# EAGLE design master (EAGLE 9.2.2)
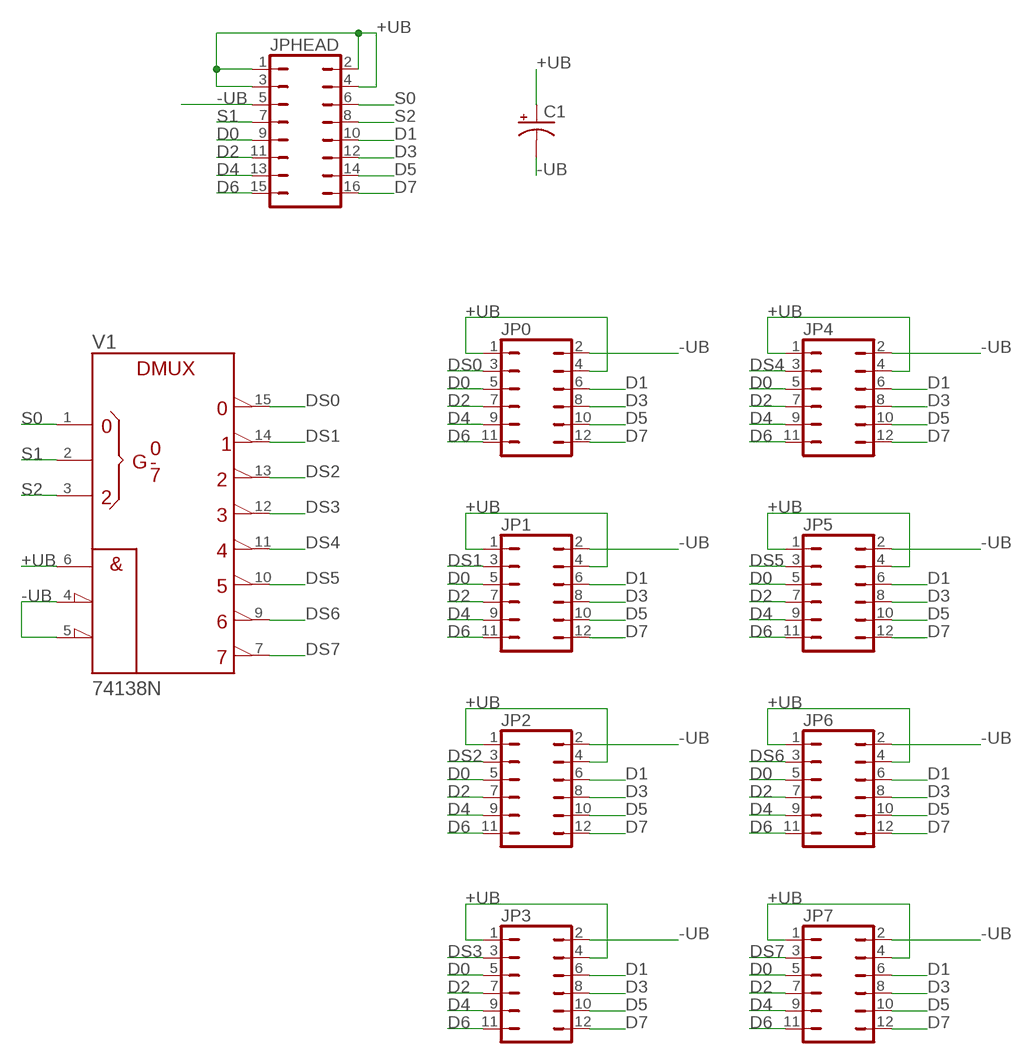
[diagram p0: schematic, sheet 1]

## Parts
C1  CPOL-USTT2D4  [TT2D4]
JP0  JP6Q  [JP6Q]
JP1  JP6Q  [JP6Q]
JP2  JP6Q  [JP6Q]
JP3  JP6Q  [JP6Q]
JP4  JP6Q  [JP6Q]
JP5  JP6Q  [JP6Q]
JP6  JP6Q  [JP6Q]
JP7  JP6Q  [JP6Q]
JPHEAD  JP8Q  [JP8Q]
V1  74138N  [DIL16]

## Nets
+UB: C1.+ JP0.1 JP0.4 JP1.1 JP1.4 JP2.1 JP2.4 JP3.1 JP3.4 JP4.1 JP4.4 JP5.1 JP5.4 JP6.1 JP6.4 JP7.1 JP7.4 JPHEAD.1 JPHEAD.2 JPHEAD.3 JPHEAD.4 V1.6(G1)
-UB: C1.- JP0.2 JP1.2 JP2.2 JP3.2 JP4.2 JP5.2 JP6.2 JP7.2 JPHEAD.5 V1.4(!G2A) V1.5(!G2B)
D0: JP0.5 JP1.5 JP2.5 JP3.5 JP4.5 JP5.5 JP6.5 JP7.5 JPHEAD.9
D1: JP0.6 JP1.6 JP2.6 JP3.6 JP4.6 JP5.6 JP6.6 JP7.6 JPHEAD.10
D2: JP0.7 JP1.7 JP2.7 JP3.7 JP4.7 JP5.7 JP6.7 JP7.7 JPHEAD.11
D3: JP0.8 JP1.8 JP2.8 JP3.8 JP4.8 JP5.8 JP6.8 JP7.8 JPHEAD.12
D4: JP0.9 JP1.9 JP2.9 JP3.9 JP4.9 JP5.9 JP6.9 JP7.9 JPHEAD.13
D5: JP0.10 JP1.10 JP2.10 JP3.10 JP4.10 JP5.10 JP6.10 JP7.10 JPHEAD.14
D6: JP0.11 JP1.11 JP2.11 JP3.11 JP4.11 JP5.11 JP6.11 JP7.11 JPHEAD.15
D7: JP0.12 JP1.12 JP2.12 JP3.12 JP4.12 JP5.12 JP6.12 JP7.12 JPHEAD.16
DS0: JP0.3 V1.15(Y0)
DS1: JP1.3 V1.14(Y1)
DS2: JP2.3 V1.13(Y2)
DS3: JP3.3 V1.12(Y3)
DS4: JP4.3 V1.11(Y4)
DS5: JP5.3 V1.10(Y5)
DS6: JP6.3 V1.9(Y6)
DS7: JP7.3 V1.7(Y7)
S0: JPHEAD.6 V1.1(A)
S1: JPHEAD.7 V1.2(B)
S2: JPHEAD.8 V1.3(C)

## Power pins joined to a net without a drawn wire
+UB: V1.16(+UB)
-UB: V1.8(-UB)

## Library data of the parts
C1 = rcl:CPOL-US: POLARIZED CAPACITOR, American symbol; SPICEPREFIX: C
JP0 JP1-JP7 = jumper:JP6Q: JUMPER
JPHEAD = jumper:JP8Q: JUMPER
V1 = 74ttl-din:74*138: 3-line to 8-line DECODER/DEMULTIPLEXER

## Board
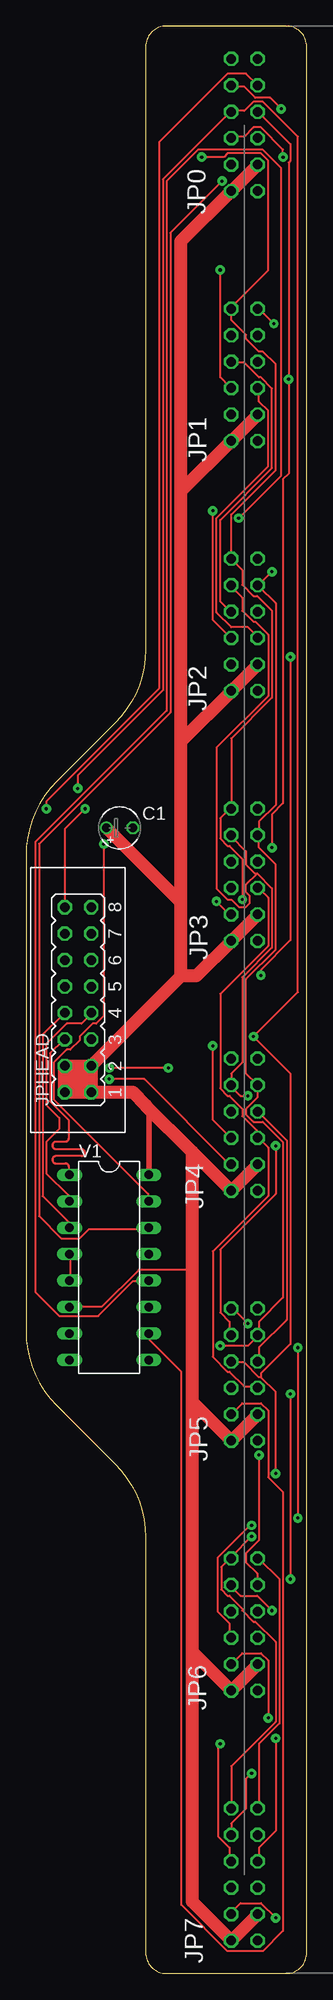
[diagram p1: board, top side]
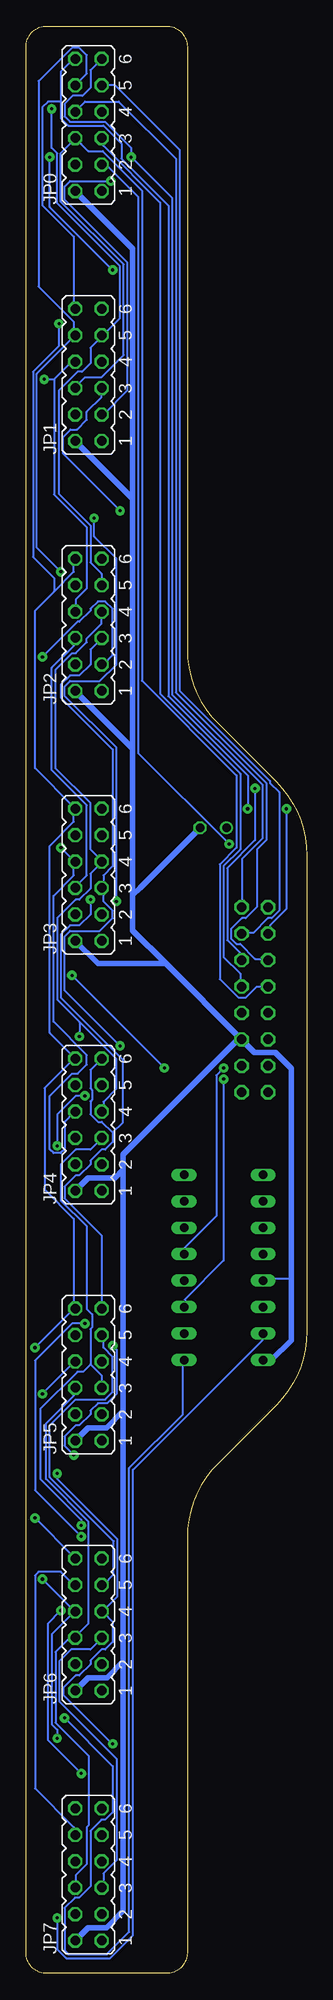
[diagram p2: board, bottom side, seen from below]

Size 27 x 187 mm. Coordinates in mm from the lower left corner, seen from the top.
Outline: 11.5,41.86 11.5,2 arc90 13.5,0 25,0 arc90 27,2 27,185 arc90 25,187 13.5,187 arc90 11.5,185 11.5,127.14 arc-45 8.57,120.07 2.93,114.43 arc45 0,107.36 0,61.64 arc45 2.93,54.57 8.57,48.93 arc-45 11.5,41.86
Copper layers (1*16): Top 0.035mm / dielectric 1.6mm / Bottom 0.035mm
Design rules "default *": minimum track width 8mil, minimum drill 0.3mm, track to track 6mil, track to pad 6mil, pad to pad 6mil, via to via 6mil, smd to smd 6mil, copper to edge 10mil, drill to drill 6mil, minimum pad ring 5mil, minimum via ring 0.3mm, stop-mask expansion 4mil, vias tented up to drill 0mil, thermal gap 10mil

### Footprints (pad centres in the part's own frame; a part is rotated, then mirrored left to right if it is on the bottom)
TT2D4 = drill 0.813: + -1.27,0 | drill 0.813 octagon: - 1.27,0
JP6Q = drill 0.914 octagon: 1 -6.35,-1.27; 2 -6.35,1.27; 3 -3.81,-1.27; 4 -3.81,1.27; 5 -1.27,-1.27; 6 -1.27,1.27; 7 1.27,-1.27; 8 1.27,1.27; 9 3.81,-1.27; 10 3.81,1.27; 11 6.35,-1.27; 12 6.35,1.27
JP8Q = drill 0.914 octagon: 1 -8.89,-1.27; 2 -8.89,1.27; 3 -6.35,-1.27; 4 -6.35,1.27; 5 -3.81,-1.27; 6 -3.81,1.27; 7 -1.27,-1.27; 8 -1.27,1.27; 9 1.27,-1.27; 10 1.27,1.27; 11 3.81,-1.27; 12 3.81,1.27; 13 6.35,-1.27; 14 6.35,1.27; 15 8.89,-1.27; 16 8.89,1.27
DIL16 = drill 0.813 long: 1 -8.89,-3.81; 2 -6.35,-3.81; 3 -3.81,-3.81; 4 -1.27,-3.81; 5 1.27,-3.81; 6 3.81,-3.81; 7 6.35,-3.81; 8 8.89,-3.81; 9 8.89,3.81; 10 6.35,3.81; 11 3.81,3.81; 12 1.27,3.81; 13 -1.27,3.81; 14 -3.81,3.81; 15 -6.35,3.81; 16 -8.89,3.81

### Placement (x,y rotation side)
C1  9,110 0 top
JP0  21,177.5 90 bottom
JP1  21,153.5 90 bottom
JP2  21,129.5 90 bottom
JP3  21,105.5 90 bottom
JP4  21,81.5 90 bottom
JP5  21,57.5 90 bottom
JP6  21,33.5 90 bottom
JP7  21,9.5 90 bottom
JPHEAD  5,93.5 90 top
V1  8,67.8 270 top

### Tracks (layer width: path | path; a pad name or v marks a point on that pad's centre or on a via)
+UB
  Top 0.203: 15.99,67.56 10.85,67.56 7.29,64.01 4.27,64.01 V1.6
  Top 0.508: V1.16 11.81,83.07 11.52,83.36
  Top 1.27: JPHEAD.4 JPHEAD.1 | JPHEAD.3 JPHEAD.2 | JPHEAD.2 JPHEAD.4 | JPHEAD.4 JPHEAD.3 | JPHEAD.3 JPHEAD.1 | JPHEAD.1 JPHEAD.2 | JPHEAD.3 14.9,95.78 | 14.9,142.32 JP1.1 JP1.4 | 14.9,95.78 14.9,102.83 | 14.9,102.83 14.9,118.32 | 14.9,118.32 14.9,142.32 | JP2.4 JP2.1 14.9,118.32 | JP3.4 JP3.1 16.36,95.78 14.9,95.78 | C1.+ 14.9,102.83 | 15.99,78.89 JP4.1 JP4.4 | 15.99,78.89 11.52,83.36 10.27,84.61 JPHEAD.1 | 15.99,54.89 JP5.1 JP5.4 | 15.99,54.89 15.99,67.56 15.99,78.89 | 15.99,30.89 JP6.1 JP6.4 | 15.99,30.89 15.99,54.89 | JP7.4 JP7.1 15.99,6.89 15.99,30.89 | 14.9,142.32 14.9,166.32 JP0.1 JP0.4
-UB
  Top 0.203: V1.5 4.27,66.67 4.27,68.99 V1.4
  Bottom 0.203: 1.5,66.67 4.09,66.67 V1.5
  Bottom 0.508: 13.54,96.96 16.75,100.17 16.75,103.52 16.73,103.53 | 13.54,96.96 JPHEAD.5 | 16.73,141.62 16.73,117.61 | 16.73,117.61 16.73,103.53 | JP3.2 20.08,96.96 13.54,96.96 | C1.- 16.05,104.22 16.73,103.53 | JP2.2 16.73,117.61 | JP1.2 16.73,141.62 | V1.8 3.39,58.91 1.5,60.8 1.5,66.67 1.5,86.9 3.05,88.45 5.03,88.45 JPHEAD.5 | JP4.2 21.02,76.4 18.45,76.4 17.65,77.2 | 17.65,77.2 17.65,78.65 6.61,89.69 JPHEAD.5 | JP5.2 21.02,52.4 19.25,52.4 17.65,54 | 17.65,54 17.65,77.2 | JP6.2 21.02,28.4 19.2,28.4 17.65,29.95 | 17.65,29.95 17.65,54 | JP7.2 21.02,4.4 19.25,4.4 17.65,6 17.65,29.95 | JP0.2 16.73,165.62 16.73,141.62
D0  (via drill 0.3)
  Top 0.203: v17.96,140.46 17.96,129.97 19.56,128.37 JP2.5 | v21.69,43.03 21.51,43.03 18.41,39.93 18.41,34.75 19.56,33.6 19.56,32.36 JP6.5 | v17.96,89.08 17.96,81.97 19.56,80.37 JP4.5 | v24.71,174.42 24.71,175.13 22.58,177.27 21.87,177.27 20.98,176.38 19.74,176.38 JP0.5 | v18.67,163.58 18.67,153.26 19.56,152.38 JP1.5
  Bottom 0.203: JPHEAD.9 6.4,94.94 6.4,96.01 8,97.61 8,106.32 6.4,107.92 6.4,115.21 14.11,122.92 14.11,170.04 19.56,175.49 19.56,176.2 JP0.5 | JP2.5 19.74,128.19 20.8,127.13 20.8,125.7 21.87,124.64 22.76,124.64 23.65,123.75 23.65,122.5 18.67,117.53 18.67,106.32 19.56,105.44 19.56,104.37 JP3.5 19.56,104.19 19.56,102.95 18.67,102.06 18.67,101.35 19.91,100.1 22.76,100.1 23.29,99.57 23.29,94.41 v17.96,89.08 | v17.96,140.46 23.44,145.95 23.44,147.52 22.71,148.26 22.1,148.26 21.16,149.2 21.16,149.96 19.74,151.38 19.74,152.2 JP1.5 | JP7.5 19.56,8.36 19.56,9.6 18.31,10.85 18.31,20.62 23.8,26.11 23.8,29.99 22.68,31.11 20.8,31.11 19.74,32.18 JP6.5 | 20.8,58.5 19.74,57.43 19.74,56.36 JP5.5 | 20.8,58.5 20.8,61.87 20.62,62.05 20.62,63.3 21.16,63.83 21.16,71.76 23.65,74.25 23.65,77.7 22.23,79.12 20.8,79.12 19.74,80.19 JP4.5 | v21.69,43.03 21.69,43.56 25.62,47.49 25.62,54.21 22.05,57.78 21.51,57.78 20.8,58.5 | v24.71,174.42 24.71,169.62 v18.67,163.58
D1
  Top 0.203: JP3.6 22.4,104.19 23.29,103.3 23.29,98.68 18.67,94.06 18.67,84.99 19.38,84.28 19.56,84.28 20.8,83.03 20.8,82.32 22.23,80.9 22.23,80.37 JP4.6 22.4,80.19 23.29,79.3 23.29,74.68 17.96,69.34 17.96,59.21 19.38,57.78 19.56,57.78 20.98,56.36 22.23,56.36 JP5.6 | JP1.6 22.4,152.2 22.4,150.95 23.29,150.06 23.29,144.73 18.31,139.75 18.31,130.68 19.74,129.26 21.34,129.26 22.23,128.37 JP2.6
  Bottom 0.203: 22.23,176.2 21.69,175.67 21.01,174.98 19.64,174.98 15.86,171.21 15.86,124.14 6.76,115.04 6.76,108.1 8.36,106.5 8.36,95.48 6.58,93.7 5.87,93.7 4.8,94.77 JPHEAD.10 | 22.23,176.2 22.24,176.22 23.65,174.81 23.65,170.16 17.6,164.11 17.6,155.4 19.74,153.26 21.34,153.26 22.23,152.38 JP1.6 | 22.23,176.2 JP0.6 | JP7.6 22.23,8.36 22.23,9.42 21.16,10.49 21.16,14.05 20.98,14.22 20.98,20.91 24.15,24.08 24.15,30.88 22.8,32.23 JP6.6 22.23,32.36 20.98,33.6 20.98,43.38 25.07,47.47 25.07,52.81 22.4,55.47 22.4,56.19 JP5.6 | JP2.6 22.4,128.19 22.4,127.48 24.51,125.38 24.51,115.54 21.16,112.19 21.16,105.44 22.23,104.37 JP3.6
D2  (via drill 0.3)
  Top 0.203: v4.98,113.79 4.98,115.04 13.16,123.22 13.16,172.29 19.56,178.69 JP0.7 19.74,178.87 20.98,178.87 21.87,179.76 22.76,179.76 26.14,176.38 26.14,94.23 v21.87,89.97 25.43,86.41 25.43,60.45 22.58,57.61 22.58,57.25 | v18.67,22.05 18.47,21.85 18.47,13.18 19.56,12.09 19.56,10.85 JP7.7 | 22.58,57.25 22.4,57.25 20.98,58.67 19.74,58.67 JP5.7 | 22.58,57.25 24,55.83 v24,48.01 | JP1.7 19.74,154.69 20.98,154.69 22.4,153.26 22.58,153.26 23.65,152.2 23.65,144.55 18.67,139.57 18.67,131.75 19.56,130.86 JP2.7
  Bottom 0.203: v4.98,113.79 4.98,108.81 7.64,106.15 7.64,99.21 6.4,97.97 6.4,97.43 JPHEAD.11 | v18.67,22.05 18.72,22.05 23.44,26.77 23.44,27.41 22.23,28.63 21.87,28.63 20.8,29.69 20.8,30.05 19.74,31.11 19.38,31.11 18.67,31.83 18.67,33.78 19.56,34.67 JP6.7 19.56,34.85 18.21,36.19 18.21,41.68 24,47.47 v24,48.01 | 21.83,91.35 24,93.52 24,101.35 22.23,103.12 21.87,103.12 20.8,104.19 20.8,105.61 19.74,106.68 JP3.7 19.74,106.86 20.8,107.92 20.8,112.37 24.15,115.72 24.15,125.2 22.58,126.77 22.23,126.77 21.16,127.84 21.16,128.19 19.74,129.62 19.74,130.68 JP2.7 | 21.83,91.35 18.32,87.84 18.32,84.94 19.56,83.7 19.56,82.86 JP4.7 | 21.83,91.35 21.85,91.35 21.85,90 v21.87,89.97
D3  (via drill 0.3)
  Top 0.203: v24,22.58 24,13.69 22.4,12.09 22.4,10.85 JP7.8 | JP5.8 22.4,58.85 22.4,60.1 25.07,62.76 25.07,80.01 22.4,82.68 JP4.8 | v25.43,55.65 v25.43,37.87 | JP0.8 22.4,178.69 25.43,175.67 25.43,174.07 25.25,173.89 v25.25,153.09 25.25,144.02 24.71,143.49 24.71,112.37 23.65,111.3 v23.65,108.1
  Bottom 0.203: v24,22.58 24,23.4 24.51,23.9 24.51,32.56 22.4,34.67 JP6.8 22.4,34.85 v25.43,37.87 | JP4.8 22.4,82.68 23.29,81.79 23.29,79.12 23.65,78.77 24.36,78.77 24.71,79.12 24.71,84.28 22.58,86.41 22.02,86.41 21.16,87.28 21.16,88.19 24.36,91.39 24.36,103.48 22.4,105.44 22.4,106.68 JP3.8 22.4,106.86 v23.65,108.1 | v25.43,55.65 22.4,58.67 JP5.8 | 24.3,153.09 24.3,142.01 21.16,138.86 21.16,132.99 22.23,131.93 22.23,130.86 JP2.8 | 24.3,153.09 22.8,154.59 22.52,154.77 JP1.8 | JPHEAD.12 3.73,97.43 4.98,97.43 6.4,98.86 6.76,98.86 7.29,99.39 7.29,100.28 6.22,101.35 5.87,101.35 4.8,102.41 4.8,107.92 3.91,108.81 3.91,114.33 12.59,123 12.59,174.27 18.08,179.76 21.34,179.76 22.23,178.87 JP0.8 | v25.25,153.09 24.3,153.09
D4  (via drill 0.3)
  Top 0.203: v21.69,19.2 21.16,18.67 21.16,15.82 19.74,14.4 19.74,13.34 JP7.9 | v23.65,34.85 22.23,36.27 20.62,36.27 19.74,37.16 JP6.9 | 22.23,105.61 22.2,105.64 22.02,105.64 21.16,106.5 21.16,107.75 19.74,109.17 JP3.9 | 22.23,105.61 23.65,104.19 23.65,98.5 20.8,95.66 20.8,87.48 19.74,86.41 19.74,85.34 JP4.9 19.74,85.17 20.62,84.28 v21.34,84.28 | 22.23,105.61 21.16,104.55 21.16,103.83 21.51,103.48 21.51,102.77 21.16,102.41 20.45,102.41 19.74,103.12 19.38,103.12 18.31,104.19 18.31,117.7 23.29,122.68 23.29,128.55 22.05,129.79 21.87,129.79 20.8,130.86 20.8,132.1 19.74,133.17 JP2.9 | v24,79.48 24,74.85 18.67,69.52 18.67,63.48 19.56,62.59 19.56,61.34 JP5.9 | v24.54,179.04 23.47,180.11 22.05,180.11 20.98,181.18 19.74,181.18 JP0.9
  Bottom 0.203: JPHEAD.13 6.22,99.92 5.16,99.92 3.73,101.35 3.38,101.35 2.67,102.06 2.67,113.44 3.56,114.33 3.56,114.5 12.23,123.18 12.23,175.1 18.44,181.31 JP0.9 | v21.69,19.2 24.91,22.43 24.91,33.58 v23.65,34.85 | JP5.9 19.56,61.16 19.56,60.1 18.67,59.21 18.67,55.83 19.38,55.12 22.23,55.12 24.71,52.63 24.71,47.65 18.57,41.51 18.57,38.33 19.56,37.34 JP6.9 | JP2.9 19.74,133.35 19.74,134.42 20.8,135.48 20.8,139.04 23.85,142.08 23.85,152 22.05,153.8 21.62,153.8 20.8,154.61 20.8,156.11 19.74,157.18 JP1.9 19.56,157.35 17.96,158.95 17.96,163.93 24,169.98 24,174.78 24.54,175.31 v24.54,179.04 | v24,79.48 24,82.5 22.23,84.28 v21.34,84.28
D5  (via drill 0.3)
  Top 0.203: v1.96,111.84 1.96,112.55 12.8,123.39 12.8,175.84 19.38,182.42 21.16,182.42 22.23,181.36 JP0.10 | v22.4,49.78 22.4,41.6 21.16,40.36 21.16,39.47 22.23,38.41 22.23,37.34 JP6.10 | v18.67,60.27 21.34,60.27 22.23,61.16 JP5.10 22.4,61.34 22.4,62.59 24.71,64.9 24.71,79.83 22.76,81.79 21.87,81.79 21.16,82.5 21.16,83.03 22.23,84.1 22.23,85.17 JP4.10 22.23,85.34 21.16,86.41 21.16,95.48 24,98.32 24,106.5 22.4,108.1 22.4,109.17 JP3.10 22.4,109.35 22.4,110.59 24,112.19 24,131.57 22.4,133.17 JP2.10 22.4,133.35 v23.65,134.59
  Bottom 0.203: v1.96,111.84 1.96,102.23 3.56,100.64 3.56,99.92 JPHEAD.14 | JP0.10 22.23,181.36 21.16,182.42 21.16,184.2 21.87,184.91 22.58,184.91 25.78,181.71 25.78,161.98 22.4,158.6 22.4,157.35 JP1.10 22.4,157.18 25.96,153.62 25.96,136.91 v23.65,134.59 | JP7.10 22.4,13.34 22.4,14.05 26.14,17.78 26.14,38.23 25.78,38.58 23.65,38.58 22.4,37.34 JP6.10 | v22.4,49.78 23.29,50.67 23.29,51.56 22.23,52.63 21.87,52.63 20.8,53.7 20.8,54.05 20.09,54.76 19.2,54.76 18.31,55.65 18.31,59.92 v18.67,60.27
D6  (via drill 0.3)
  Top 0.203: JP7.11 19.74,16 19.74,19.91 24,24.18 24,31.83 22.05,33.78 21.87,33.78 20.8,34.85 20.8,35.03 19.56,36.27 19.38,36.27 18.77,36.88 18.77,39.04 19.56,39.83 JP6.11 19.74,40.01 v21.69,41.96 | v20.8,103.12 20.8,107.04 19.56,108.28 19.38,108.28 18.67,108.99 18.67,110.95 19.56,111.84 JP3.11 19.74,112.01 19.74,118.59 23.65,122.5 23.65,130.86 22.23,132.28 21.87,132.28 20.8,133.35 20.8,134.77 19.74,135.84 JP2.11 19.74,136.02 19.74,140.11 24,144.37 24,154.51 22.76,155.75 22.4,155.75 21.16,157 21.16,157.35 19.74,158.78 JP1.11 19.74,160.02 23.29,163.58 23.29,174.07 22.58,174.78 19.38,174.78 19.02,174.42 v16.89,174.42 | v21.34,62.41 19.74,64.01 JP5.11
  Bottom 0.203: JPHEAD.15 6.22,102.41 6.22,107.04 4.27,108.99 4.27,114.15 12.95,122.83 12.95,170.52 16.89,174.46 v16.89,174.42 16.89,175.31 19.38,177.8 22.76,177.8 23.29,178.33 23.29,179.52 22.52,180.29 21.57,180.29 20.8,181.06 20.8,182.78 JP0.11 | 18.66,80.73 19.71,81.79 20.09,81.79 20.8,82.5 20.8,83.74 20.62,83.92 20.62,84.81 20.8,84.99 20.8,86.77 19.74,87.83 JP4.11 | 18.66,80.73 18.67,80.72 18.67,79.83 19.38,79.12 19.74,79.12 20.8,78.05 20.8,77.7 21.87,76.63 22.23,76.63 23.29,75.56 23.29,74.43 19.74,70.87 19.74,64.01 JP5.11 | 18.66,80.73 17.71,81.68 17.71,87.77 23.65,93.7 23.65,99.75 22.76,100.64 21.87,100.64 20.8,101.7 v20.8,103.12 | v21.69,41.96 26.14,46.41 26.14,58.85 22.58,62.41 v21.34,62.41
D7  (via drill 0.3)
  Top 0.203: v5.69,111.84 3.73,109.88 3.73,102.41 JPHEAD.16 | JP7.12 22.4,16 22.4,22.05 24.36,24 24.36,37.87 22.4,39.83 JP6.12 | v26.14,60.1 v26.14,43.74 | v23.82,158.42 22.4,159.84 JP1.12
  Bottom 0.203: v5.69,111.84 5.69,115.04 13.3,122.65 13.3,169.77 17.82,174.28 17.82,175.71 19.56,177.44 22.94,177.44 23.65,178.16 23.65,179.76 | 23.65,179.76 23.65,182.6 22.4,183.84 JP0.12 | 23.65,179.76 24.89,179.76 25.43,179.22 25.43,169.8 22.4,166.78 22.4,160.02 JP1.12 | 24.3,132.7 26.14,130.86 26.14,115.75 22.4,112.01 JP3.12 22.4,111.84 22.4,110.59 24.71,108.28 24.71,90.32 22.4,88.01 JP4.12 22.4,87.83 25.22,85.02 25.22,75.29 22.4,72.47 22.4,64.01 JP5.12 22.4,63.83 v26.14,60.1 | 24.3,132.7 22.4,134.59 22.4,135.84 JP2.12 | v26.14,43.74 22.4,40.01 JP6.12 | v23.82,158.42 23.82,156.29 26.31,153.8 26.31,136.02 24.3,134 24.3,132.7
DS0  (via drill 0.3)
  Top 0.203: v7.47,108.46 7.47,91.92 6.76,91.21 6.4,91.21 5.16,89.97 5.16,89.61 4.27,88.72 3.91,88.72 2.67,87.48 2.67,83.92 11.73,74.85 11.73,74.32 V1.15
  Bottom 0.203: v7.47,108.46 16.22,117.21 16.22,170.6 19.31,173.69 JP0.3
DS1  (via drill 0.3)
  Top 0.203: v18.85,172.11 13.87,167.13 13.87,121.08 1.25,108.46 1.25,72.72 3.38,70.59 5.16,70.59 6.04,71.48 11.73,71.48 V1.14
  Bottom 0.203: v18.85,172.11 22.76,172.11 23.29,171.58 23.29,170.33 17.25,164.29 17.25,152.02 19.56,149.71 JP1.3
DS2  (via drill 0.3)
  Top 0.203: v13.69,86.94 v8,86.94 | v22.58,95.83 22.58,96.37 25.43,99.21 v25.43,126.42
  Bottom 0.203: v8,86.94 8.71,86.23 8.71,72.72 11.73,69.7 11.73,69.16 V1.13 | v22.58,95.83 v13.69,86.94 | v25.43,126.42 22.05,129.79 21.87,129.79 20.8,130.86 20.8,131.04 20.09,131.75 19.38,131.75 18.67,131.04 18.67,126.59 19.56,125.7 JP2.3
DS3  (via drill 0.3)
  Top 0.203: v20.45,139.75 24.54,143.84 24.54,173.35 22.76,175.13 16.54,175.13 13.51,172.11 13.51,121.26 0.89,108.64 0.89,65.43 3.2,63.12 6.93,63.12 10.31,66.5 11.73,66.5 V1.12 | v18.31,102.95 19.56,101.7 JP3.3
  Bottom 0.203: v20.45,139.75 20.45,137.97 18.31,135.84 18.31,125.7 19.91,124.1 22.76,124.1 23.29,123.57 23.29,122.68 18.31,117.7 v18.31,102.95
DS4  (via drill 0.3)
  Top 0.203: v8,85.88 11.38,85.88 19.56,77.7 JP4.3
  Bottom 0.203: v8,85.88 8,68.45 11.73,64.72 11.73,64.01 V1.11
DS5
  Top 0.203: V1.10 11.91,61.34 11.91,60.81 14.94,57.78 14.94,6.58 19.38,2.13 22.76,2.13 24.71,4.09 24.71,46.23 23.29,47.65 23.29,54.05 22.58,54.76 20.8,54.76 JP5.3
DS6  (via drill 0.3)
  Top 0.203: v23.29,24.54 23.29,30.05 22.58,30.76 20.8,30.76 JP6.3
  Bottom 0.203: v23.29,24.54 18.67,19.91 18.67,15.47 19.38,14.76 19.74,14.76 20.8,13.69 20.8,8.36 21.87,7.29 22.3,7.29 23.29,6.29 23.29,2.22 22.91,1.83 19.23,1.83 17.07,4 17.07,48.54 11.91,53.7 11.91,58.85 V1.9
DS7  (via drill 0.3)
  Top 0.203: v24,5.33 22.58,6.76 20.62,6.76 19.74,5.87 JP7.3
  Bottom 0.203: v24,5.33 24,2.35 23.14,1.48 18.9,1.48 16.71,3.67 16.71,48.36 4.27,60.81 4.27,61.34 V1.7
S0
  Top 0.203: V1.1 4.09,76.81 4.09,77.5 arc90 3.8,77.79 2.85,77.79 arc-90 2.55,78.08 2.55,78.19 arc-90 2.85,78.48 5.33,78.48 arc90 5.62,78.77 5.62,78.88 arc90 5.33,79.17 2.85,79.17 arc-90 2.55,79.46 2.55,79.57 arc-90 2.85,79.86 3.8,79.86 arc90 4.09,80.15 4.09,81.97 2.31,83.74 2.31,88.37 3.56,89.61 JPHEAD.6
S1
  Top 0.203: V1.2 4.09,74.32 4.09,74.7 1.96,76.84 1.96,79.86 3.2,81.1 3.2,82.15 1.96,83.39 1.96,89.26 3.91,91.21 5.33,91.21 6.22,92.1 JPHEAD.7
S2
  Top 0.203: V1.3 4.09,71.65 4.09,72.17 1.6,74.65 1.6,90.14 3.56,92.1 JPHEAD.8

### Text on the board
tNames: JP0 | JP1 | JP2 | JP3 | JP4 | JP5 | JP6 | JP7